# Altium schematic sheet LU9685-20CU舵机控制模块原理图.SchDoc
size A4
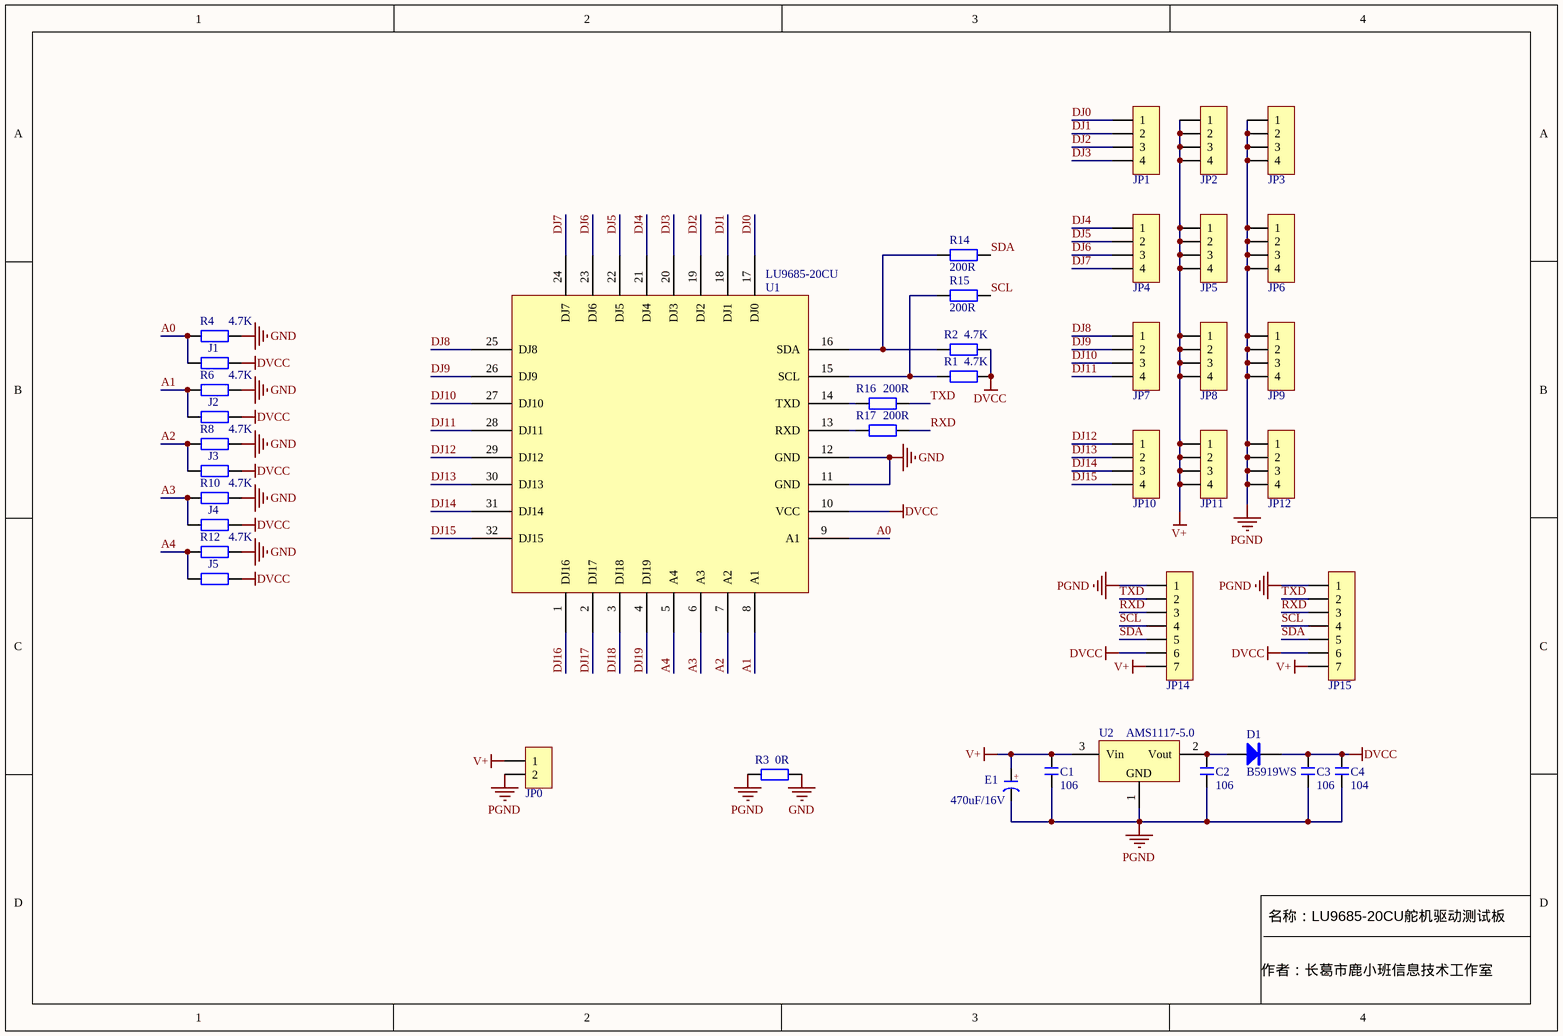
[diagram p0: LU9685-20CU舵机控制模块原理图.SchDoc]

## Parts
C1  106  [C 0805_L]
C2  106  [C 0805_L]
C3  106  [C 0805_L]
C4  104  [C 0603_L]
D1  B5919WS  [SOD-323]
E1  470uF/16V  [CAP 3.5*8*11.5]
J1  (no value)  [R 0805_L]
J2  (no value)  [R 0805_L]
J3  (no value)  [R 0805_L]
J4  (no value)  [R 0805_L]
J5  (no value)  [R 0805_L]
JP0  HDR-1X2  [KF350-2P]  (value not drawn)
JP1  HDR-1X4  [HDR2.54-LI-4P]  (value not drawn)
JP2  HDR-1X4  [HDR2.54-LI-4P]  (value not drawn)
JP3  HDR-1X4  [HDR2.54-LI-4P]  (value not drawn)
JP4  HDR-1X4  [HDR2.54-LI-4P]  (value not drawn)
JP5  HDR-1X4  [HDR2.54-LI-4P]  (value not drawn)
JP6  HDR-1X4  [HDR2.54-LI-4P]  (value not drawn)
JP7  HDR-1X4  [HDR2.54-LI-4P]  (value not drawn)
JP8  HDR-1X4  [HDR2.54-LI-4P]  (value not drawn)
JP9  HDR-1X4  [HDR2.54-LI-4P]  (value not drawn)
JP10  HDR-1X4  [HDR2.54-LI-4P]  (value not drawn)
JP11  HDR-1X4  [HDR2.54-LI-4P]  (value not drawn)
JP12  HDR-1X4  [HDR2.54-LI-4P]  (value not drawn)
JP14  HDR-1X7  [HDR2.54-LI-7P]  (value not drawn)
JP15  HDR-1X7  [HDR2.54-LI-7P]  (value not drawn)
R1  4.7K  [R 0603_L]
R2  4.7K  [R 0603_L]
R3  0R  [R 0603_L]
R4  4.7K  [R 0603_L]
R6  4.7K  [R 0603_L]
R8  4.7K  [R 0603_L]
R10  4.7K  [R 0603_L]
R12  4.7K  [R 0603_L]
R14  200R  [R 0603_L]
R15  200R  [R 0603_L]
R16  200R  [R 0603_L]
R17  200R  [R 0603_L]
U1  LU9685-20CU  [LQFP32 7X7_L]
U2  AMS1117-5.0  [SOT89_L]

## Nets
DVCC: C3.2 C4.2 D1.2(K) J1.1 J2.1 J3.1 J4.1 J5.1 JP14.6 JP15.6 R1.2 R2.2 U1.10(VCC)
GND: R3.2 R4.1 R6.1 R8.1 R10.1 R12.1 U1.11(GND) U1.12(GND)
PGND: C1.1 C2.1 C3.1 C4.1 E1.2(K) JP0.2 JP3.1 JP3.2 JP3.3 JP3.4 JP6.1 JP6.2 JP6.3 JP6.4 JP9.1 JP9.2 JP9.3 JP9.4 JP12.1 JP12.2 JP12.3 JP12.4 JP14.1 JP15.1 R3.1 U2.1(GND)
V+: C1.2 E1.1(A) JP0.1 JP2.1 JP2.2 JP2.3 JP2.4 JP5.1 JP5.2 JP5.3 JP5.4 JP8.1 JP8.2 JP8.3 JP8.4 JP11.1 JP11.2 JP11.3 JP11.4 JP14.7 JP15.7 U2.3(Vin)
A0: J1.2 R4.2 U1.9(A1)
A1: J2.2 R6.2 U1.8(A1)
A2: J3.2 R8.2 U1.7(A2)
A3: J4.2 R10.2 U1.6(A3)
A4: J5.2 R12.2 U1.5(A4)
DJ0: JP1.1 U1.17(DJ0)
DJ1: JP1.2 U1.18(DJ1)
DJ2: JP1.3 U1.19(DJ2)
DJ3: JP1.4 U1.20(DJ3)
DJ4: JP4.1 U1.21(DJ4)
DJ5: JP4.2 U1.22(DJ5)
DJ6: JP4.3 U1.23(DJ6)
DJ7: JP4.4 U1.24(DJ7)
DJ8: JP7.1 U1.25(DJ8)
DJ9: JP7.2 U1.26(DJ9)
DJ10: JP7.3 U1.27(DJ10)
DJ11: JP7.4 U1.28(DJ11)
DJ12: JP10.1 U1.29(DJ12)
DJ13: JP10.2 U1.30(DJ13)
DJ14: JP10.3 U1.31(DJ14)
DJ15: JP10.4 U1.32(DJ15)
DJ16: U1.1(DJ16)
DJ17: U1.2(DJ17)
DJ18: U1.3(DJ18)
DJ19: U1.4(DJ19)
RXD: JP14.3 JP15.3 R17.1
SCL: JP14.4 JP15.4 R15.2
SDA: JP14.5 JP15.5 R14.2
TXD: JP14.2 JP15.2 R16.1
NetC2_2: C2.2 D1.1(A) U2.2(Vout)
NetR1_1: R1.1 R15.1 U1.15(SCL)
NetR2_1: R2.1 R14.1 U1.16(SDA)
NetR16_2: R16.2 U1.14(TXD)
NetR17_2: R17.2 U1.13(RXD)

## Notes on the sheet
- 名称：LU9685-20CU舵机驱动测试板
- 作者：长葛市鹿小班信息技术工作室
- (in symbol C-CAP) +

## Library data of the parts
C1-C4 = C: 无极性贴片电容; 版权归属: 源创客; BOM名称: 无极性贴片电容; 学习资源: www.ooocke.com
D1 = 1N5819: 肖特基二极管; 版权归属: 源创客; 属性: 40V/2A; BOM名称: 肖特基二极管; 学习资源: www.ooocke.com
E1 = C-CAP: 直插电解电容; 版权归属: 源创客; BOM名称: 直插电解电容; 学习资源: www.ooocke.com
J1-J5 R1-R4 R6 R8 R10 R12 R14-R17 = R: 贴片电阻; 版权归属: 源创客; BOM名称: 贴片电阻; 学习资源: www.ooocke.com
JP0 = Header 2: 2P接插件; 版权归属: 源创客; BOM名称: 2P接插件; 学习资源: www.ooocke.com
JP1-JP12 = Header 4: 4P接插件; 版权归属: 源创客; BOM名称: 4P接插件; 学习资源: www.ooocke.com
JP14 JP15 = Header 7: 7P接插件; 版权归属: 源创客; BOM名称: 7P接插件; 学习资源: www.ooocke.com
U1 = STC8H1K16
U2 = AMS1117: 三端稳压芯片; BOM名称: 稳压芯片; 版权归属: 源创客; 学习资源: www.ooocke.com